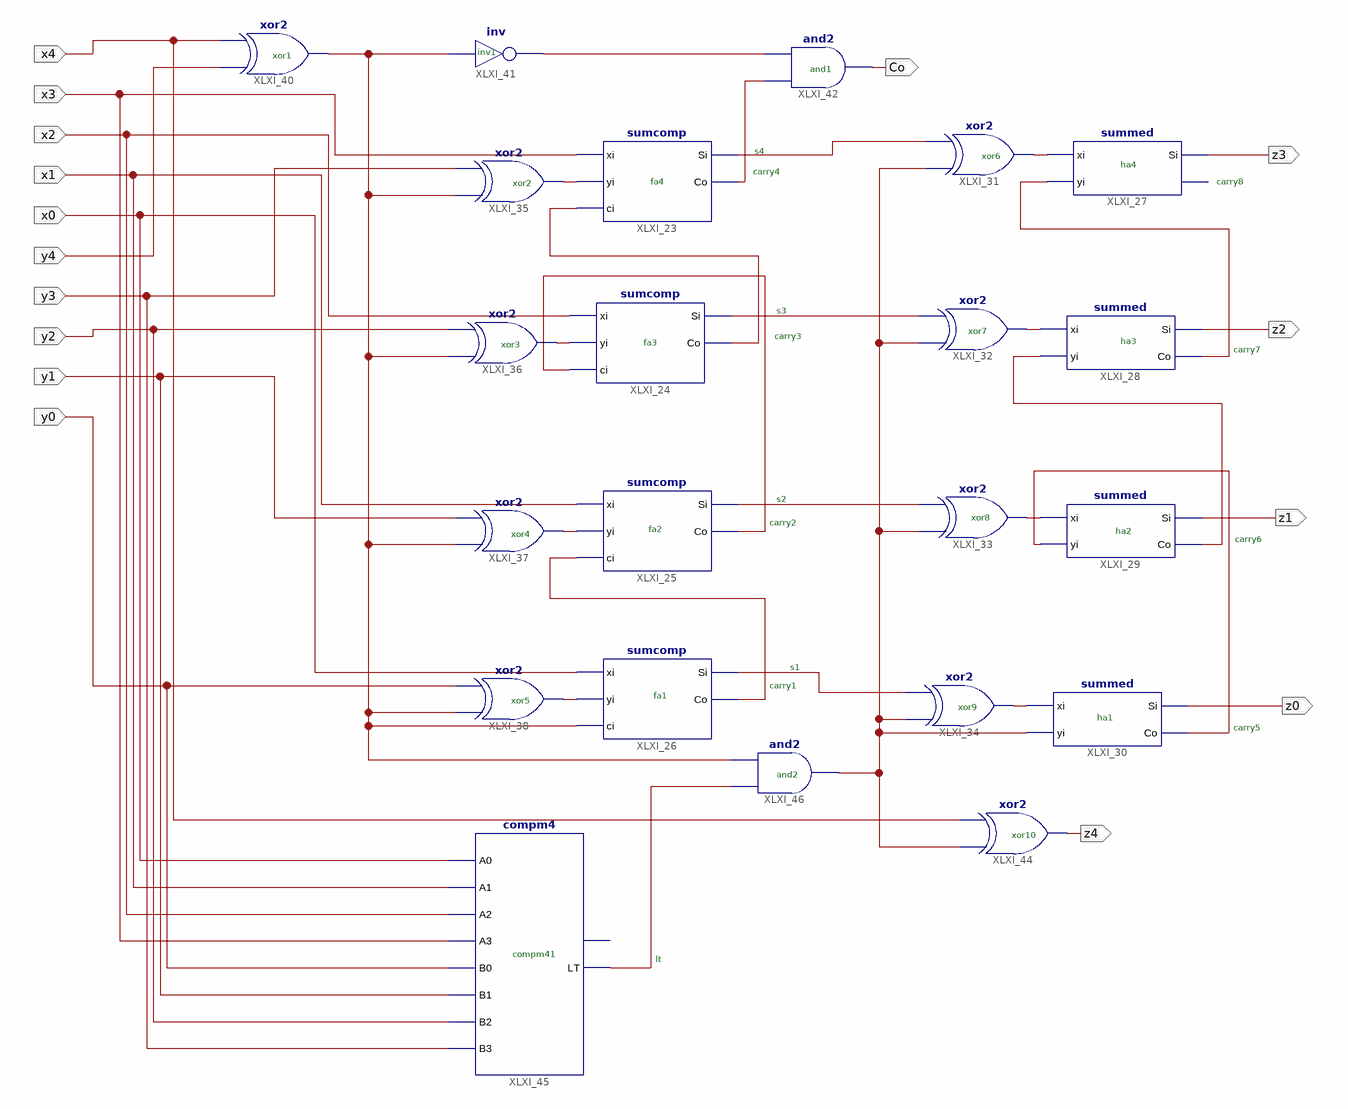
[diagram p0: schematic sheet 1]
// Xilinx ISE schematic sumador_completo_4bs.sch (spartan6) as structural Verilog: 22 symbols, 16 ports
module sumador_completo_4bs (
  input  x4,
  input  x3,
  input  x2,
  input  x1,
  input  x0,
  input  y4,
  input  y3,
  input  y2,
  input  y1,
  input  y0,
  output Co,
  output z0,
  output z1,
  output z2,
  output z3,
  output z4
);

  wire XLXN_112, XLXN_113, XLXN_114, XLXN_115, XLXN_116, XLXN_117, XLXN_118, XLXN_119, XLXN_120, XLXN_121,
       XLXN_122, XLXN_123, XLXN_124, XLXN_125, XLXN_127, XLXN_128, XLXN_129, XLXN_130, XLXN_131, XLXN_132,
       XLXN_133, XLXN_135, XLXN_136;

  sumcomp XLXI_23 (.ci(XLXN_121), .Co(XLXN_133), .Si(XLXN_122), .xi(x3), .yi(XLXN_130));
  sumcomp XLXI_24 (.ci(XLXN_120), .Co(XLXN_121), .Si(XLXN_123), .xi(x2), .yi(XLXN_129));
  sumcomp XLXI_25 (.ci(XLXN_119), .Co(XLXN_120), .Si(XLXN_124), .xi(x1), .yi(XLXN_128));
  sumcomp XLXI_26 (.ci(XLXN_131), .Co(XLXN_119), .Si(XLXN_125), .xi(x0), .yi(XLXN_127));
  summed XLXI_27 (.xi(XLXN_112), .yi(XLXN_118), .Si(z3));  // open: Co
  summed XLXI_28 (.xi(XLXN_113), .yi(XLXN_117), .Si(z2), .Co(XLXN_118));
  summed XLXI_29 (.xi(XLXN_114), .yi(XLXN_116), .Si(z1), .Co(XLXN_117));
  summed XLXI_30 (.xi(XLXN_115), .yi(XLXN_136), .Si(z0), .Co(XLXN_116));
  xor XLXI_31 (XLXN_112, XLXN_136, XLXN_122);
  xor XLXI_32 (XLXN_113, XLXN_136, XLXN_123);
  xor XLXI_33 (XLXN_114, XLXN_136, XLXN_124);
  xor XLXI_34 (XLXN_115, XLXN_136, XLXN_125);
  xor XLXI_35 (XLXN_130, XLXN_131, y3);
  xor XLXI_36 (XLXN_129, XLXN_131, y2);
  xor XLXI_37 (XLXN_128, XLXN_131, y1);
  xor XLXI_38 (XLXN_127, XLXN_131, y0);
  xor XLXI_40 (XLXN_131, y4, x4);
  not XLXI_41 (XLXN_132, XLXN_131);
  and XLXI_42 (Co, XLXN_133, XLXN_132);
  xor XLXI_44 (z4, XLXN_136, x4);
  compm4 XLXI_45 (.A0(x0), .A1(x1), .A2(x2), .A3(x3), .B0(y0), .B1(y1), .B2(y2), .B3(y3), .LT(XLXN_135));  // open: GT
  and XLXI_46 (XLXN_136, XLXN_135, XLXN_131);

  // Notes on the sheet:
  //   inv1
  //   xor1
  //   and1
  //   s4
  //   xor6
  //   ha4
  //   carry4
  //   fa4
  //   carry8
  //   xor2
  //   s3
  //   xor7
  //   carry3
  //   ha3
  //   fa3
  //   xor3
  //   carry7
  //   s2
  //   xor8
  //   carry2
  //   fa2
  //   ha2
  //   xor4
  //   carry6
  //   s1
  //   carry1
  //   fa1
  //   xor5
  //   xor9
  //   ha1
  //   carry5
  //   and2
  //   xor10
  //   compm41
  //   lt
endmodule
